# Altium schematic sheet SCU_External_Connectors.SchDoc
size B
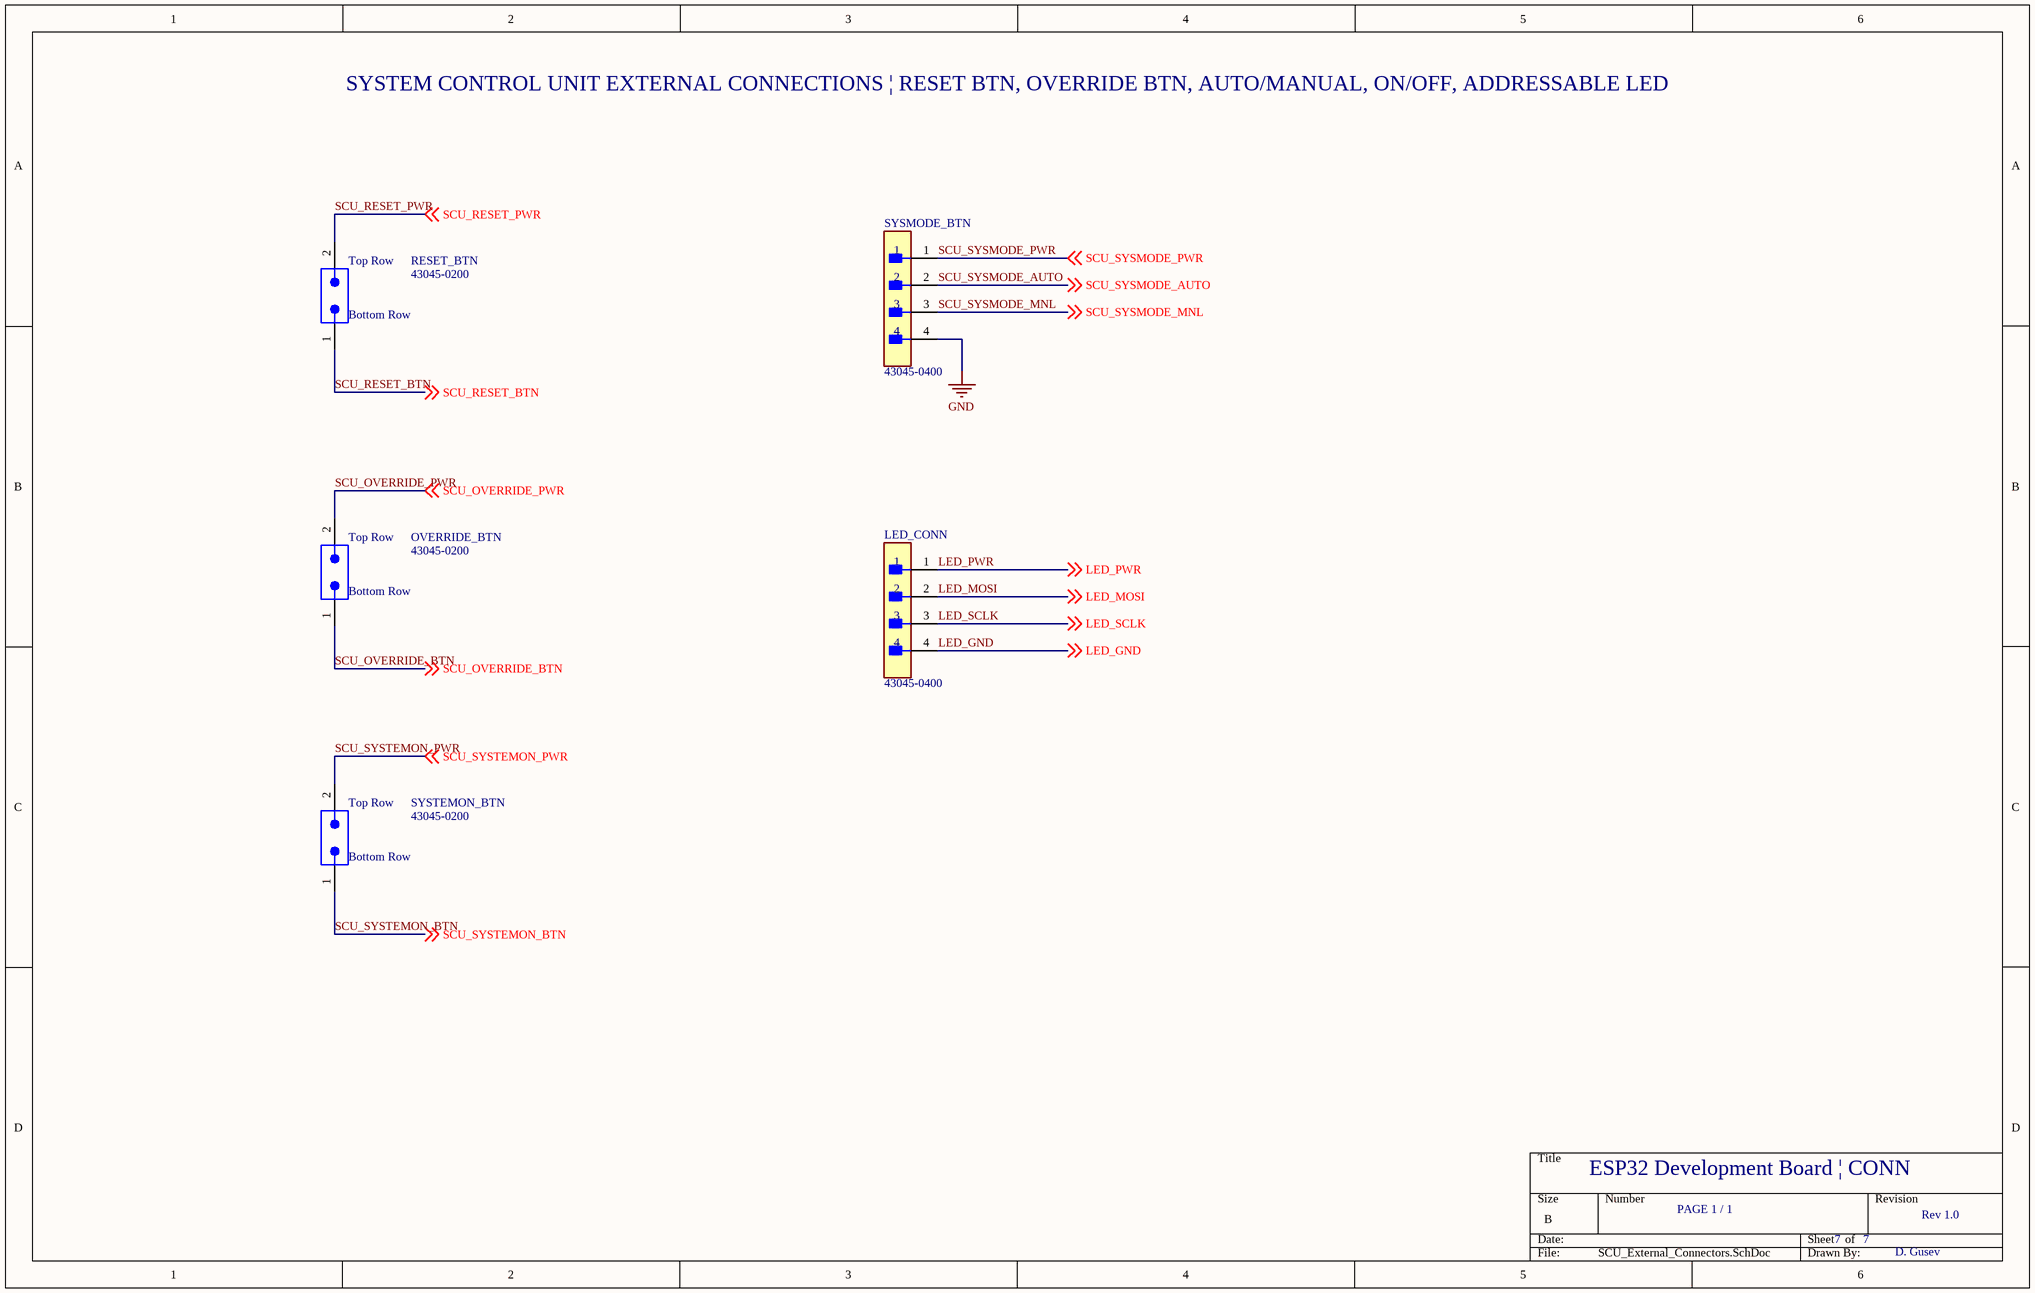
[diagram p0: SCU_External_Connectors.SchDoc]

## Parts
LED_CONN  43045-0400  [FP-43045-0400-MFG]
OVERRIDE_BTN  43045-0200  [MOLX-43045-0200]
RESET_BTN  43045-0200  [MOLX-43045-0200]
SYSMODE_BTN  43045-0400  [FP-43045-0400-MFG]
SYSTEMON_BTN  43045-0200  [MOLX-43045-0200]

## Nets
GND: SYSMODE_BTN.4
LED_GND: LED_CONN.4 ; off-sheet LED_GND
LED_MOSI: LED_CONN.2 ; off-sheet LED_MOSI
LED_PWR: LED_CONN.1 ; off-sheet LED_PWR
LED_SCLK: LED_CONN.3 ; off-sheet LED_SCLK
SCU_OVERRIDE_BTN: OVERRIDE_BTN.1 ; off-sheet SCU_OVERRIDE_BTN
SCU_OVERRIDE_PWR: OVERRIDE_BTN.2 ; off-sheet SCU_OVERRIDE_PWR
SCU_RESET_BTN: RESET_BTN.1 ; off-sheet SCU_RESET_BTN
SCU_RESET_PWR: RESET_BTN.2 ; off-sheet SCU_RESET_PWR
SCU_SYSMODE_AUTO: SYSMODE_BTN.2 ; off-sheet SCU_SYSMODE_AUTO
SCU_SYSMODE_MNL: SYSMODE_BTN.3 ; off-sheet SCU_SYSMODE_MNL
SCU_SYSMODE_PWR: SYSMODE_BTN.1 ; off-sheet SCU_SYSMODE_PWR
SCU_SYSTEMON_BTN: SYSTEMON_BTN.1 ; off-sheet SCU_SYSTEMON_BTN
SCU_SYSTEMON_PWR: SYSTEMON_BTN.2 ; off-sheet SCU_SYSTEMON_PWR

## Notes on the sheet
- SYSTEM CONTROL UNIT EXTERNAL CONNECTIONS | RESET BTN, OVERRIDE BTN, AUTO/MANUAL, ON/OFF, ADDRESSABLE LED
- ESP32 Development Board | CONN
- PAGE 1 / 1
- 7
- Rev 1.0
- D. Gusev
- (in symbol Molex 0430450-200) Top Row; Bottom Row

## Library data of the parts
LED_CONN SYSMODE_BTN = CMP-04776-000002-1: CONN HEADER R/A 4POS 3MM; Manufacturer: Molex; Conn Gender: Male; Conn Orientation: Right Angle; Voltage Rating: 600V; Number Of Contacts: 4; Is Female: yes; Current Rating: 8.5A; ComponentLink2URL: https://www.molex.com/webdocs/datasheets/pdf/en-us/0430450400_PCB_HEADERS.pdf; Manufacturer Part Number: 43045-0400; Digikey Description: CONN HEADER R/A 4POS 3MM; Category: Conn; Temperature Range High: +105°C; Lead Free: Yes; Device Class L1: Connectors; Automotive: No; Temperature: -40°C to +105°C; Footprint Url: https://www.molex.com/pdm_docs/sd/430450400_sd.pdf; Height: 9.27mm; Number Of Rows: 2; Device Class L3: unset; Pitch: 3mm; Temperature Range Low: -40°C; Contact Material: Tin,Nickel; Octopart: https://octopart.com/43045-0400-molex-287063; RoHS: TRUE; ComponentLink2Description: Datasheet; Package: 43045-0400; Device Class L2: Headers and Wire Housings
OVERRIDE_BTN RESET_BTN SYSTEMON_BTN = Molex 0430450-200: 3 mm Pitch Micro-Fit 3.0 Connector, 17.27 mm Mated Height, Vertical, Through Hole, 2 Circuits, -40 to 105 degC, RoHS, Tray; PartNumber: 43045-0812; Pitch: 3 mm; No. of Positions: 8; No. of Rows: 2; ComponentLink2Description: Datasheet; ComponentLink2URL: http://www.molex.com/webdocs/datasheets/pdf/en-us/0430450812_PCB_HEADERS.pdf; Orientation: Vertical; Packing: Tray; Temperature Min: -40 degC; RoHS: TRUE; ComponentLink3Description: Package Specification; Temperature Max: 105 degC; ComponentLink3URL: http://www.molex.com/pdm_docs/sd/430450812_sd.pdf; Mounting Technology: Through Hole; PackageVersion: Rev. F, 06/2009; ComponentLink1Description: Manufacturer URL; PackageDescription: 8-Pin PCB Header, Vertical, Pitch 3 mm, Mated Height 17.27 mm, Through Hole; ComponentLink1URL: http://www.molex.com/